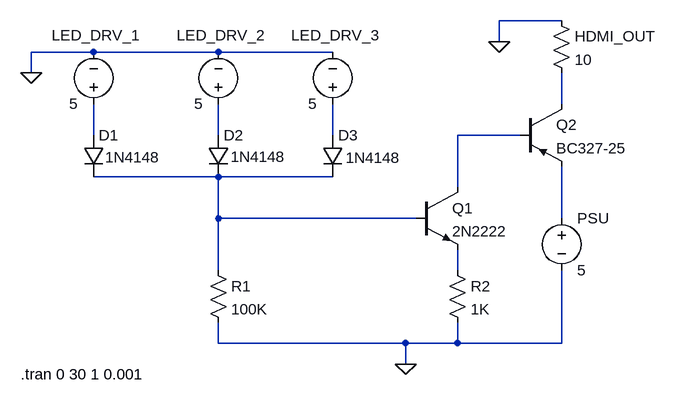
[diagram p0: schematic hdmi_switch_cond_pwr.asc]
hdmi_switch_cond_pwr.asc, the LTspice schematic file:
Version 4.1
SHEET 1 880 680
WIRE 528 -608 432 -608
WIRE 432 -576 432 -608
WIRE -192 -560 -288 -560
WIRE 0 -560 -192 -560
WIRE 176 -560 0 -560
WIRE -288 -528 -288 -560
WIRE 528 -480 528 -528
WIRE -192 -432 -192 -480
WIRE 0 -432 0 -480
WIRE 176 -432 176 -480
WIRE 464 -432 368 -432
WIRE 0 -368 -192 -368
WIRE 176 -368 0 -368
WIRE 368 -352 368 -432
WIRE 0 -304 0 -368
WIRE 304 -304 0 -304
WIRE 528 -304 528 -384
WIRE 0 -224 0 -304
WIRE 368 -224 368 -256
WIRE 0 -112 0 -144
WIRE 288 -112 0 -112
WIRE 368 -112 368 -144
WIRE 368 -112 288 -112
WIRE 528 -112 528 -224
WIRE 528 -112 368 -112
WIRE 288 -80 288 -112
FLAG -288 -528 0
FLAG 432 -576 0
FLAG 288 -80 0
SYMBOL res -16 -240 R0
SYMATTR InstName R1
SYMATTR Value 100K
SYMBOL diode -208 -432 R0
WINDOW 3 34 34 Left 2
SYMATTR Value 1N4148
SYMATTR InstName D1
SYMBOL diode -16 -432 R0
WINDOW 3 35 33 Left 2
SYMATTR Value 1N4148
SYMATTR InstName D2
SYMBOL diode 160 -432 R0
WINDOW 3 36 35 Left 2
SYMATTR Value 1N4148
SYMATTR InstName D3
SYMBOL voltage -192 -464 R180
WINDOW 0 -73 122 Left 2
WINDOW 3 24 16 Left 2
WINDOW 123 0 0 Left 0
WINDOW 39 0 0 Left 0
SYMATTR InstName LED_DRV_1
SYMATTR Value 5
SYMBOL voltage 0 -464 R180
WINDOW 0 -73 122 Left 2
WINDOW 3 24 16 Left 2
WINDOW 123 0 0 Left 0
WINDOW 39 0 0 Left 0
SYMATTR InstName LED_DRV_2
SYMATTR Value 5
SYMBOL voltage 176 -464 R180
WINDOW 0 -73 122 Left 2
WINDOW 3 24 16 Left 2
WINDOW 123 0 0 Left 0
WINDOW 39 0 0 Left 0
SYMATTR InstName LED_DRV_3
SYMATTR Value 5
SYMBOL npn 304 -352 R0
SYMATTR InstName Q1
SYMATTR Value 2N2222
SYMBOL res 352 -240 R0
SYMATTR InstName R2
SYMATTR Value 1K
SYMBOL pnp 464 -480 R0
SYMATTR InstName Q2
SYMATTR Value BC327-25
SYMBOL voltage 528 -320 R0
WINDOW 123 0 0 Left 0
WINDOW 39 0 0 Left 0
SYMATTR InstName PSU
SYMATTR Value 5
SYMBOL res 512 -624 R0
SYMATTR InstName HDMI_OUT
SYMATTR Value 10
TEXT -304 -64 Left 2 !.tran 0 30 1 0.001

The netlist it stands for:
* hdmi_switch_cond_pwr.asc
R1 N006 0 100K
D1 N002 N006 1N4148
D2 N003 N006 1N4148
D3 N004 N006 1N4148
V§LED_DRV_1 N002 0 5
V§LED_DRV_2 N003 0 5
V§LED_DRV_3 N004 0 5
Q1 N005 N006 N008 0 2N2222
R2 N008 0 1K
Q2 N001 N005 N007 0 BC327-25
V§PSU N007 0 5
R§HDMI_OUT 0 N001 10
.model D D
.lib standard.dio
.model NPN NPN
.model PNP PNP
.lib standard.bjt
.tran 0 30 1 0.001
.backanno
.end